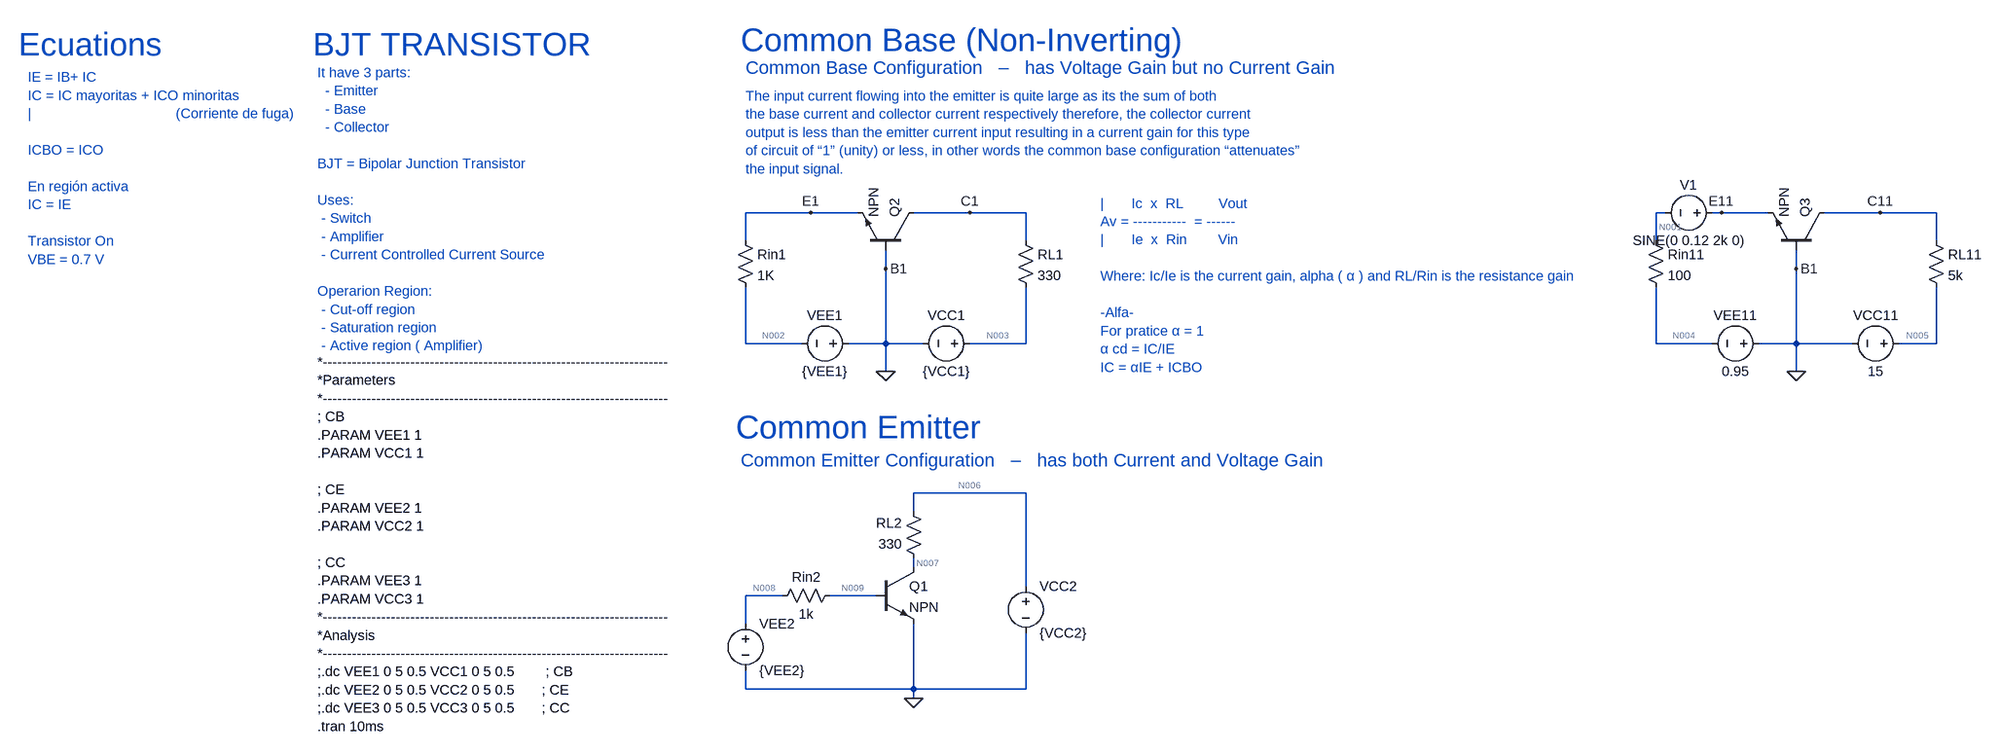
[diagram p0: schematic BJT.asc]
BJT.asc, the LTspice schematic file:
Version 4
SHEET 1 4076 1016
WIRE 352 16 240 16
WIRE 432 16 352 16
WIRE 624 16 528 16
WIRE 720 16 624 16
WIRE 1872 16 1856 16
WIRE 1968 16 1952 16
WIRE 2048 16 1968 16
WIRE 2240 16 2144 16
WIRE 2336 16 2240 16
WIRE 240 64 240 16
WIRE 720 64 720 16
WIRE 1856 64 1856 16
WIRE 2336 64 2336 16
WIRE 480 112 480 80
WIRE 2096 112 2096 80
WIRE 240 240 240 144
WIRE 336 240 240 240
WIRE 480 240 480 112
WIRE 480 240 416 240
WIRE 544 240 480 240
WIRE 720 240 720 144
WIRE 720 240 624 240
WIRE 1856 240 1856 144
WIRE 1952 240 1856 240
WIRE 2096 240 2096 112
WIRE 2096 240 2032 240
WIRE 2192 240 2096 240
WIRE 2336 240 2336 144
WIRE 2336 240 2272 240
WIRE 480 288 480 240
WIRE 2096 288 2096 240
WIRE 720 496 528 496
WIRE 528 528 528 496
WIRE 528 624 528 608
WIRE 720 656 720 496
WIRE 304 672 240 672
WIRE 464 672 384 672
WIRE 240 720 240 672
WIRE 240 832 240 800
WIRE 528 832 528 720
WIRE 528 832 240 832
WIRE 720 832 720 736
WIRE 720 832 528 832
WIRE 528 848 528 832
FLAG 528 848 0
FLAG 480 288 0
FLAG 480 112 B1
FLAG 624 16 C1
FLAG 352 16 E1
FLAG 2096 288 0
FLAG 2096 112 B1
FLAG 2240 16 C11
FLAG 1968 16 E11
SYMBOL voltage 432 240 R90
WINDOW 0 -32 56 VBottom 2
WINDOW 3 32 56 VTop 2
WINDOW 123 0 0 Left 0
WINDOW 39 0 0 Left 0
SYMATTR InstName VEE1
SYMATTR Value {VEE1}
SYMBOL voltage 640 240 M270
WINDOW 0 32 56 VTop 2
WINDOW 3 -32 56 VBottom 2
SYMATTR InstName VCC1
SYMATTR Value {VCC1}
SYMBOL res 224 48 R0
SYMATTR InstName Rin1
SYMATTR Value 1K
SYMBOL res 704 48 R0
SYMATTR InstName RL1
SYMATTR Value 330
SYMBOL npn 528 80 M270
SYMATTR InstName Q2
SYMBOL voltage 240 704 R0
WINDOW 123 0 0 Left 0
WINDOW 39 0 0 Left 0
SYMATTR InstName VEE2
SYMATTR Value {VEE2}
SYMBOL res 400 656 R90
WINDOW 0 0 56 VBottom 2
WINDOW 3 32 56 VTop 2
SYMATTR InstName Rin2
SYMATTR Value 1k
SYMBOL res 544 624 R180
WINDOW 0 36 76 Left 2
WINDOW 3 36 40 Left 2
SYMATTR InstName RL2
SYMATTR Value 330
SYMBOL voltage 720 640 R0
SYMATTR InstName VCC2
SYMATTR Value {VCC2}
SYMBOL npn 464 624 R0
SYMATTR InstName Q1
SYMBOL voltage 2048 240 R90
WINDOW 0 -32 56 VBottom 2
WINDOW 3 32 56 VTop 2
WINDOW 123 0 0 Left 0
WINDOW 39 0 0 Left 0
SYMATTR InstName VEE11
SYMATTR Value 0.95
SYMBOL voltage 2288 240 M270
WINDOW 0 32 56 VTop 2
WINDOW 3 -32 56 VBottom 2
WINDOW 123 0 0 Left 0
WINDOW 39 0 0 Left 0
SYMATTR InstName VCC11
SYMATTR Value 15
SYMBOL res 1840 48 R0
SYMATTR InstName Rin11
SYMATTR Value 100
SYMBOL res 2320 48 R0
SYMATTR InstName RL11
SYMATTR Value 5k
SYMBOL npn 2144 80 M270
SYMATTR InstName Q3
SYMBOL voltage 1968 16 R90
WINDOW 0 -32 56 VBottom 2
WINDOW 3 32 56 VTop 2
WINDOW 123 0 0 Left 0
WINDOW 39 0 0 Left 0
SYMATTR InstName V1
SYMATTR Value SINE(0 0.12 2k 0)
TEXT -544 -272 Left 5 ;BJT TRANSISTOR
TEXT -536 -224 Left 2 ;It have 3 parts:\n  - Emitter\n  - Base\n  - Collector\n \nBJT = Bipolar Junction Transistor\n \nUses:\n - Switch\n - Amplifier\n - Current Controlled Current Source\n \nOperarion Region:\n - Cut-off region\n - Saturation region\n - Active region ( Amplifier)
TEXT -536 272 Left 2 !*-----------------------------------------------------------------------\n*Parameters\n*-----------------------------------------------------------------------\n; CB\n.PARAM VEE1 1\n.PARAM VCC1 1\n \n; CE\n.PARAM VEE2 1\n.PARAM VCC2 1\n \n; CC\n.PARAM VEE3 1\n.PARAM VCC3 1\n*-----------------------------------------------------------------------\n*Analysis\n*-----------------------------------------------------------------------\n;.dc VEE1 0 5 0.5 VCC1 0 5 0.5        ; CB\n;.dc VEE2 0 5 0.5 VCC2 0 5 0.5       ; CE\n;.dc VEE3 0 5 0.5 VCC3 0 5 0.5       ; CC\n.tran 10ms
TEXT 224 384 Left 5 ;Common Emitter
TEXT 232 -280 Left 5 ;Common Base (Non-Inverting)
TEXT 848 0 Left 2 ;|       Ic  x  RL         Vout\nAv = -----------  = ------\n|       Ie  x  Rin        Vin\n \nWhere: Ic/Ie is the current gain, alpha ( α ) and RL/Rin is the resistance gain\n \n-Alfa-\nFor pratice α = 1\nα cd = IC/IE\nIC = αIE + ICBO
TEXT 240 -232 Left 3 ;Common Base Configuration   –   has Voltage Gain but no Current Gain
TEXT 232 440 Left 3 ;Common Emitter Configuration   –   has both Current and Voltage Gain
TEXT 240 -184 Left 2 ;The input current flowing into the emitter is quite large as its the sum of both \nthe base current and collector current respectively therefore, the collector current \noutput is less than the emitter current input resulting in a current gain for this type \nof circuit of “1” (unity) or less, in other words the common base configuration “attenuates” \nthe input signal.
TEXT -1048 -272 Left 5 ;Ecuations
TEXT -1032 -216 Left 2 ;IE = IB+ IC\nIC = IC mayoritas + ICO minoritas\n|                                     (Corriente de fuga)\n \nICBO = ICO\n \nEn región activa\nIC = IE\n \nTransistor On\nVBE = 0.7 V

The netlist it stands for:
* BJT.asc
VEE1 0 N002 {VEE1}
VCC1 N003 0 {VCC1}
Rin1 E1 N002 1K
RL1 C1 N003 330
Q2 C1 0 E1 0 NPN
VEE2 N008 0 {VEE2}
Rin2 N009 N008 1k
RL2 N007 N006 330
VCC2 N006 0 {VCC2}
Q1 N007 N009 0 0 NPN
VEE11 0 N004 0.95
VCC11 N005 0 15
Rin11 N001 N004 100
RL11 C11 N005 5k
Q3 C11 0 E11 0 NPN
V1 E11 N001 SINE(0 0.12 2k 0)
.model NPN NPN
.model PNP PNP
.lib standard.bjt
* BJT TRANSISTOR
* It have 3 parts:
*   - Emitter
*   - Base
*   - Collector
* BJT = Bipolar Junction Transistor
* Uses:
*  - Switch
*  - Amplifier
*  - Current Controlled Current Source
* Operarion Region:
*  - Cut-off region
*  - Saturation region
*  - Active region ( Amplifier)
*-----------------------------------------------------------------------
*Parameters
*-----------------------------------------------------------------------
; CB
.PARAM VEE1 1
.PARAM VCC1 1
; CE
.PARAM VEE2 1
.PARAM VCC2 1
; CC
.PARAM VEE3 1
.PARAM VCC3 1
*-----------------------------------------------------------------------
*Analysis
*-----------------------------------------------------------------------
;.dc VEE1 0 5 0.5 VCC1 0 5 0.5        ; CB
;.dc VEE2 0 5 0.5 VCC2 0 5 0.5       ; CE
;.dc VEE3 0 5 0.5 VCC3 0 5 0.5       ; CC
.tran 10ms
* Common Emitter
* Common Base (Non-Inverting)
* |       Ic  x  RL         Vout
* Av = -----------  = ------
* |       Ie  x  Rin        Vin
* Where: Ic/Ie is the current gain, alpha ( α ) and RL/Rin is the resistance gain
* -Alfa-
* For pratice α = 1
* α cd = IC/IE
* IC = αIE + ICBO
* Common Base Configuration   –   has Voltage Gain but no Current Gain
* Common Emitter Configuration   –   has both Current and Voltage Gain
* The input current flowing into the emitter is quite large as its the sum of both
* the base current and collector current respectively therefore, the collector current
* output is less than the emitter current input resulting in a current gain for this type
* of circuit of “1” (unity) or less, in other words the common base configuration “attenuates”
* the input signal.
* Ecuations
* IE = IB+ IC
* IC = IC mayoritas + ICO minoritas
* |                                     (Corriente de fuga)
* ICBO = ICO
* En región activa
* IC = IE
* Transistor On
* VBE = 0.7 V
.backanno
.end

* Results of the author's LTspice run, read from the files saved beside the schematic
* Operating Point, zero values left out:
*   V(n002) = -1 V
*   V(n003) = 1 V
*   V(e1) = -739.2 mV
*   V(c1) = 914.8 mV
*   V(n008) = 1 V
*   V(n009) = 803.7 mV
*   V(n007) = 76.12 mV
*   V(n006) = 1 V
*   V(n004) = -950 mV
*   V(n005) = 15 V
*   V(n001) = -786.7 mV
*   V(c11) = 6.914 V
*   V(e11) = -786.7 mV
*   Ic(Q2) = 258.2 µA
*   Ib(Q2) = 2.582 µA
*   Ie(Q2) = -260.8 µA
*   Ic(Q1) = 2.8 mA
*   Ib(Q1) = 196.3 µA
*   Ie(Q1) = -2.996 mA
*   Ic(Q3) = 1.617 mA
*   Ib(Q3) = 16.17 µA
*   Ie(Q3) = -1.633 mA
*   I(Rin1) = 260.8 µA
*   I(Rl1) = -258.2 µA
*   I(Rin2) = -196.3 µA
*   I(Rl2) = -2.8 mA
*   I(Rin11) = 1.633 mA
*   I(Rl11) = -1.617 mA
*   I(Vee1) = -260.8 µA
*   I(Vcc1) = -258.2 µA
*   I(Vee2) = -196.3 µA
*   I(Vcc2) = -2.8 mA
*   I(Vee11) = -1.633 mA
*   I(Vcc11) = -1.617 mA
*   I(V1) = 1.633 mA
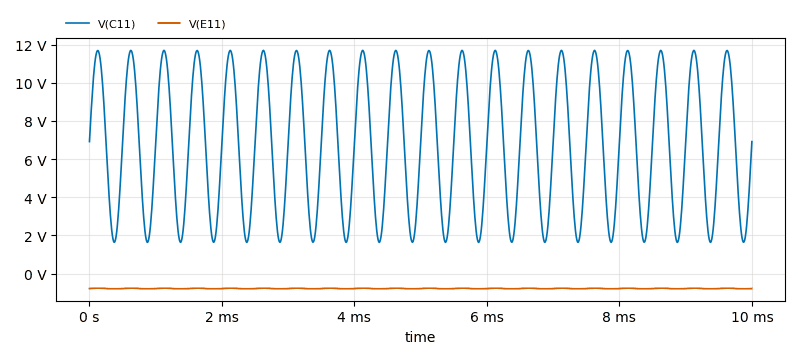
[diagram p1: Transient Analysis of BJT.asc, plotted from the saved traces]
* Transient Analysis, 1 run:
*   V(C11): min 1.632 V, max 11.69 V, average 6.792 V, rms 7.68 V, last 6.914 V
*   V(E11): min -799.7 mV, max -763.4 mV, average -784.2 mV, rms 784.3 mV, last -786.7 mV